# EAGLE schematic Plataforma_soldadora (EAGLE 6.5.0)
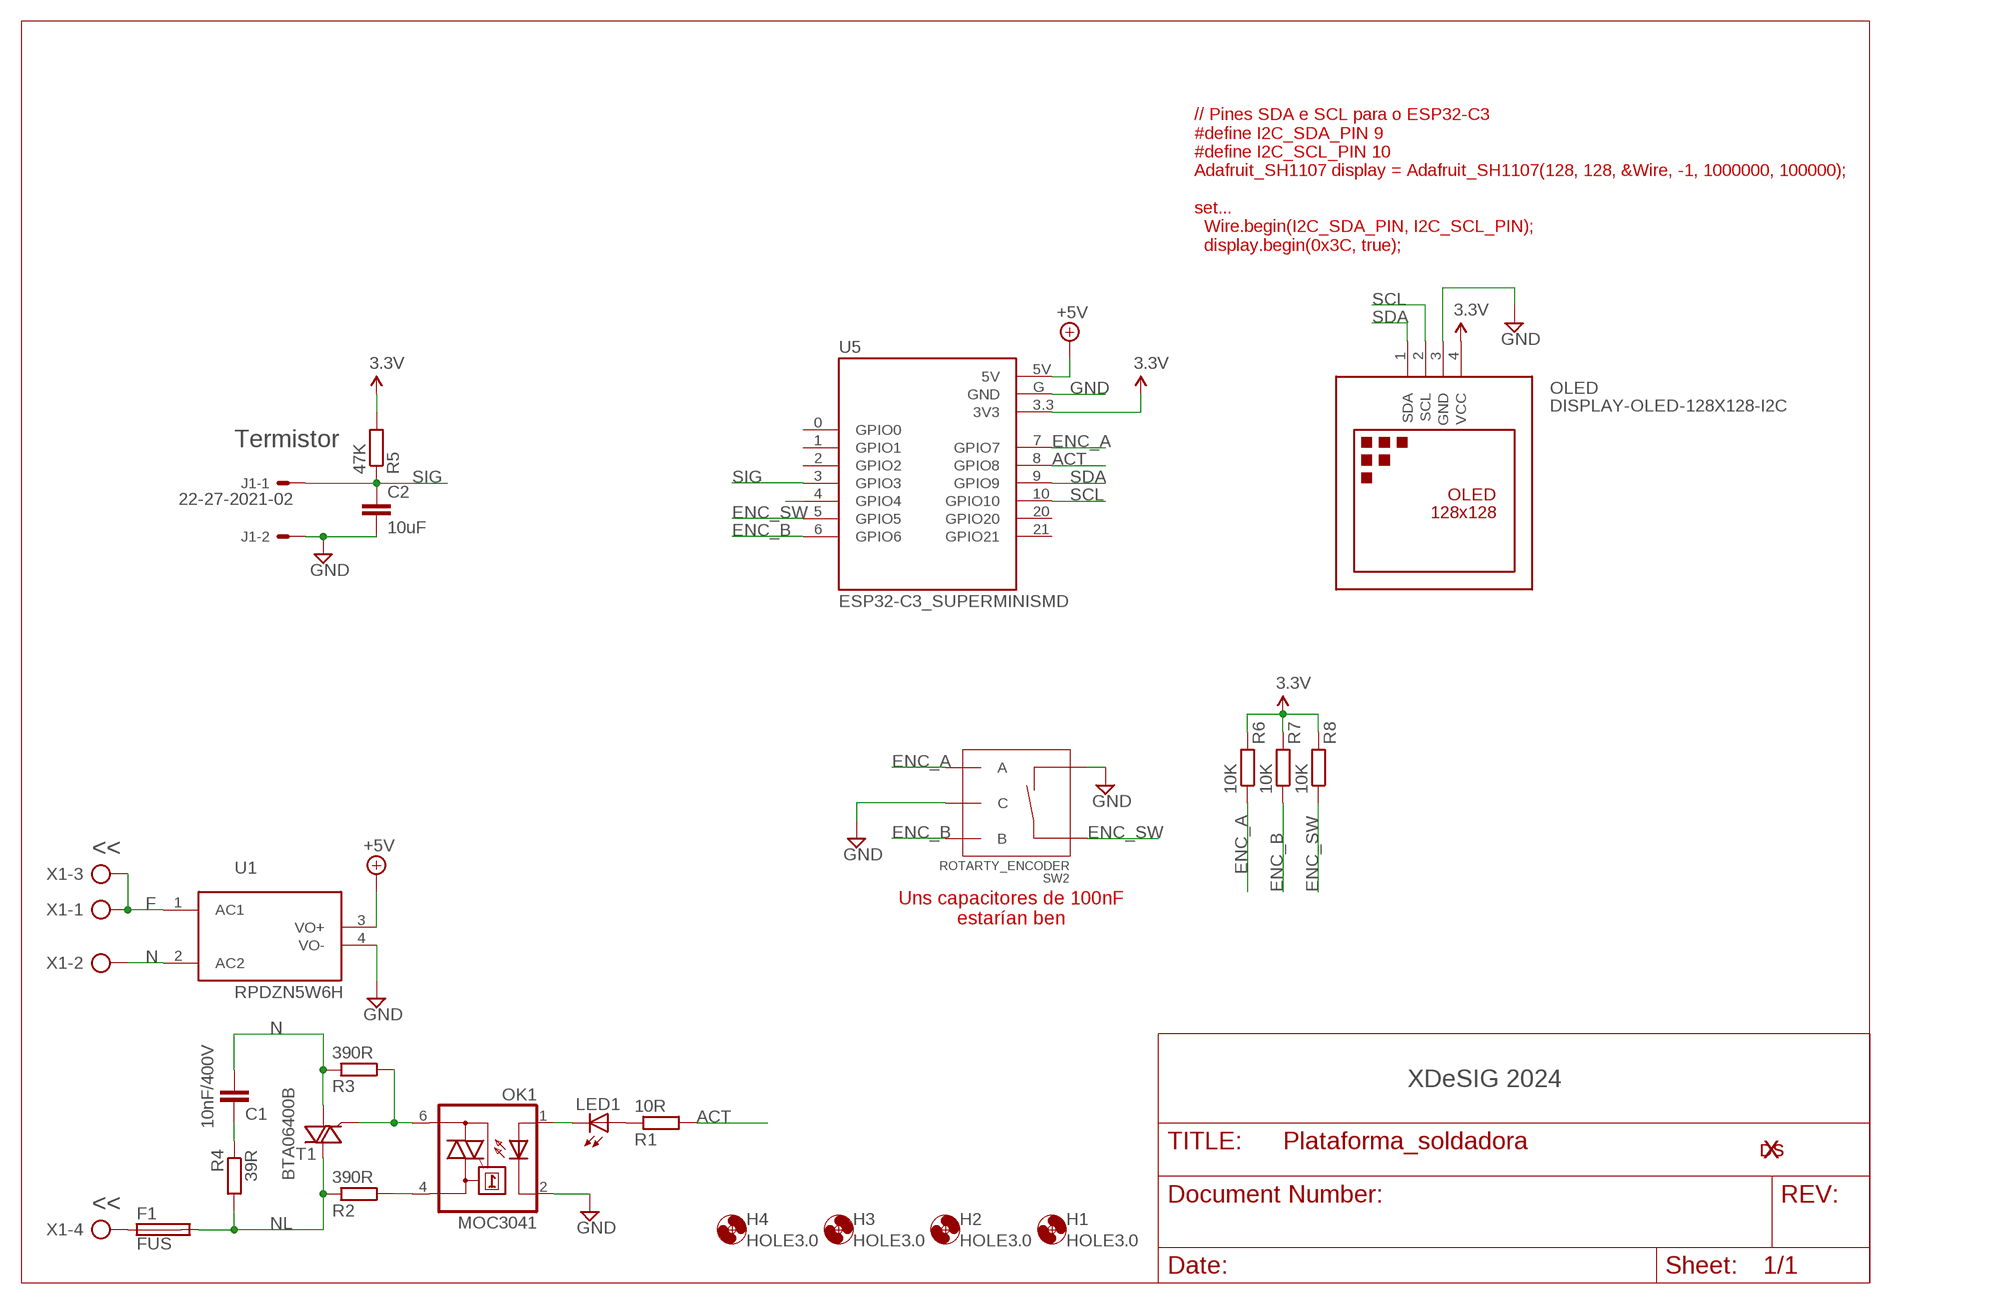
[diagram p0: schematic, sheet 1]

## Parts
C1  10nF/400V  C-EU075-042X103  [C075-042X103]
C2  10uF  C-EUC1206K  [C1206K]
F1  FUS  FUSETE5  [TE5]
H1  HOLE3.0  HOLES_MOUNT-HOLE3.0  [HOLES_3,0]
H2  HOLE3.0  HOLES_MOUNT-HOLE3.0  [HOLES_3,0]
H3  HOLE3.0  HOLES_MOUNT-HOLE3.0  [HOLES_3,0]
H4  HOLE3.0  HOLES_MOUNT-HOLE3.0  [HOLES_3,0]
J1  22-27-2021-02  [6410-02]
LED1  LED3MM  [LED3MM]
OK1  MOC3041  IL410  [DIL06]
OLED  DISPLAY-OLED-128X128-I2C  [DISPLAY-OLED-128X128-I2C]
R1  10R  R-EU_R0603  [R0603]
R2  390R  R-EU_0204/7  [0204/7]
R3  390R  R-EU_0204/7  [0204/7]
R4  39R  R-EU_0204/7  [0204/7]
R5  47K  R-EU_R0603  [R0603]
R6  10K  R-EU_R0603  [R0603]
R7  10K  R-EU_R0603  [R0603]
R8  10K  R-EU_R0603  [R0603]
SW2  ROTARTY_ENCODER  [ROTARY_ENC_PLAIN]
T1  BTA06400B  BT136  [TO220AB]
U1  RPDZN5W6H  [RPDZN5W6H]
U5  ESP32-C3_SUPERMINISMD  [MODULE_ESP-C3_SUPERMINI_SMD]
U$2  XDESIG_XDESIG5MM  [XDESIG_XDESIG_CU]
U$3  XDESIG_XDESIG21  [XDESIG_XDESIG]
X1  AK500/4-H  [AK500/4-H]

## Nets
3.3V: OLED.4(VCC) R5.2 R6.2 R7.2 R8.2 U5.3.3(3V3)
+5V: U1.3(VO+) U5.5V
ACT: R1.2 U5.8(GPIO8)
ENC_A: R6.1 SW2.A U5.7(GPIO7)
ENC_B: R7.1 SW2.B U5.6(GPIO6)
ENC_SW: R8.1 SW2.SW+ U5.5(GPIO5)
F: U1.1(AC1) X1.1 X1.3
GND: C2.2 J1.2 OK1.2(C) OLED.3(GND) SW2.C SW2.SW- U1.4(VO-) U5.G(GND)
N: C1.2 R3.1 T1.1(A1) U1.2(AC2) X1.2
N$1: OK1.4(A1) R2.2
N$2: F1.1 X1.4
N$3: OK1.6(A2) R3.2 T1.3(G)
N$4: LED1.K(C) OK1.1(A)
N$5: LED1.A R1.1
N$11: C1.1 R4.1
N$120: U5.4(GPIO4)
NL: F1.2 R2.1 R4.2 T1.2(A2)
SCL: OLED.2(SCL) U5.10(GPIO10)
SDA: OLED.1(SDA) U5.9(GPIO9)
SIG: C2.1 J1.1 R5.1 U5.3(GPIO3)
Unconnected: U5.0(GPIO0) U5.1(GPIO1) U5.2(GPIO2) U5.20(GPIO20) U5.21(GPIO21)

## Notes on the sheet
- // Pines SDA e SCL para o ESP32-C3
  #define I2C_SDA_PIN 9
  #define I2C_SCL_PIN 10
  Adafruit_SH1107 display = Adafruit_SH1107(128, 128, &Wire, -1, 1000000, 100000);
  
  set...
    Wire.begin(I2C_SDA_PIN, I2C_SCL_PIN);
    display.begin(0x3C, true);
- Termistor
- <<
- Uns capacitores de 100nF
  estarían ben
- XDeSIG 2024
- <<

## Library data of the parts
C1 C2 = rcl:C-EU: CAPACITOR, European symbol
F1 = fuse:FUSE: Fuse; OC_FARNELL: unknown; OC_NEWARK: unknown
H1-H4 = escorna_LBREscorna_CPU_2_10:HOLES_MOUNT-HOLE: MOUNTING HOLE with drill center marker
J1 = con-molex:22-?-02: CONNECTOR wire to board 2.54 mm (.1 inch) pitch header; OC_FARNELL: unknown; OC_NEWARK: unknown
LED1 = led:LED: LED OSRAM: - CHIPLED LG R971, LG N971, LY N971, LG Q971, LY Q971, LO R971, LY R971 LH N974, LH R974 LS Q976, LO Q976, LY Q976 LO Q996 - Hyper CHIPLED LW Q18S LB Q993, LB Q99A, LB R99A - SideLED LS A670, LO A670, LY A670, LG A670, LP A670 LB A673, LV A673, LT A673, LW A673 LH A674 LY A675 LS A676, LA A676, LO A676, LY A676, LW A676 LS A679, LY A679, LG A679 - Hyper Micro SIDELED® LS Y876, LA Y876, LO Y876, LY Y876 LT Y87S - SmartLED LW L88C, LW L88S LB L89C, LB L89S, LG L890 LS L89K, LO L89K, LY L89K LS L896, LA L896, LO L896, LY L896 - TOPLED LS T670, LO T670, LY T670, LG T670, LP T670 LSG T670, LSP T670, LSY T670, LOP T670, LYG T670 LG T671, LOG T671, LSG T671 LB T673, LV T673, LT T673, LW T673 LH T674 LS T676, LA T676, LO T676, LY T676, LB T676, LH T676, LSB T676, LW T676 LB T67C, LV T67C, LT T67C, LS T67K, LO T67K, LY T67K, LW E67C LS E67B, LA E67B, LO E67B, LY E67B, LB E67C, LV E67C, LT E67C LW T67C LS T679, LY T679, LG T679 LS T770, LO T770, LY T770, LG T770, LP T770 LB T773, LV T773, LT T773, LW T773 LH T774 LS E675, LA E675, LY E675, LS T675 LS T776, LA T776, LO T776, LY T776, LB T776 LHGB T686 LT T68C, LB T68C - Hyper Mini TOPLED® LB M676 - Mini TOPLED Santana® LG M470 LS M47K, LO M47K, LY M47K Source: http://www.osram.convergy.de LUXEON: - LUMILED® LXK2-PW12-R00, LXK2-PW12-S00, LXK2-PW14-U00, LXK2-PW14-V00 LXK2-PM12-R00, LXK2-PM12-S00, LXK2-PM14-U00 LXK2-PE12-Q00, LXK2-PE12-R00, LXK2-PE12-S00, LXK2-PE14-T00, LXK2-PE14-U00 LXK2-PB12-K00, LXK2-PB12-L00, LXK2-PB12-M00, LXK2-PB14-N00, LXK2-PB14-P00, LXK2-PB14-Q00 LXK2-PR12-L00, LXK2-PR12-M00, LXK2-PR14-Q00, LXK2-PR14-R00 LXK2-PD12-Q00, LXK2-PD12-R00, LXK2-PD12-S00 LXK2-PH12-R00, LXK2-PH12-S00 LXK2-PL12-P00, LXK2-PL12-Q00, LXK2-PL12-R00 Source: www.luxeon.com KINGBRIGHT: KA-3528ASYC Source: www.kingbright.com
OK1 = optocoupler:IL410: SIEMENS OPTO COUPLER; MF: VISHAY/TELEFUNKEN; MPN: IL410; OC_FARNELL: 1045434; OC_NEWARK: 58K1715
OLED = diy-modules:DISPLAY-OLED-128X128-I2C
R1-R8 = rcl:R-EU_: RESISTOR, European symbol
SW2 = SparkFun-Electromechanical:ROTARTY_ENCODER: Simple no LED rotary encoder Example: COM-09117
T1 = triac:BT136: Triac BT136 series E sensitive gate Source: http://www.nxp.com/acrobat_download/datasheets/BT136_SERIES_E_2.pdf
U1 = RPDZN:RPDZN5W6
U5 = ESP32-C3_SUPERMINI:ESP32-C3_SUPERMINI: Check availability <https://pricing.snapeda.com/parts/ESP32-C3%20SuperMini/Espressif%20Systems/view-part?ref=eda>
U$2 U$3 = Echidna_shield_LBR:XDESIG_XDESIG
X1 = con-ptr500:AK500/4-H: CONNECTOR Aug. 2004 / PTR Meßtechnik: Die Bezeichnung der Serie AK505 wurde geändert. Es handelt sich hierbei um AK500 in horizontaler Ausführung.; OC_FARNELL: unknown; OC_NEWARK: unknown